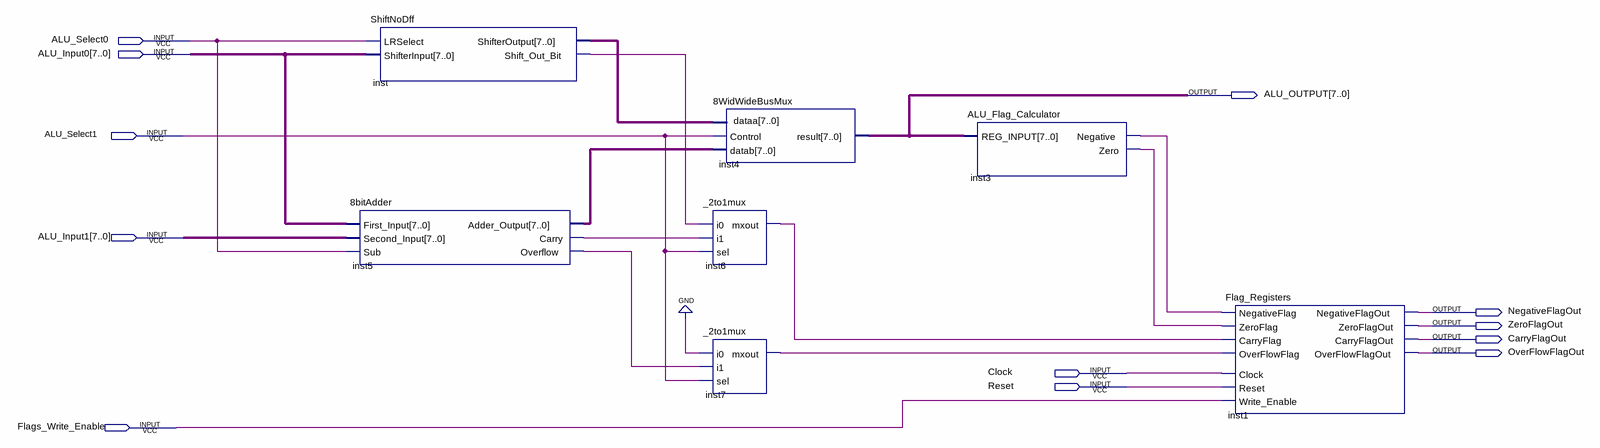
[diagram p0: schematic sheet]
// Quartus schematic ALU.bdf as structural Verilog: 7 symbols, 12 pins
module ALU (
  input  ALU_Select0,
  input  [7:0] ALU_Input0,
  input  ALU_Select1,
  input  [7:0] ALU_Input1,
  input  Clock,
  input  Reset,
  input  Flags_Write_Enable,
  output [7:0] ALU_OUTPUT,
  output NegativeFlagOut,
  output ZeroFlagOut,
  output CarryFlagOut,
  output OverFlowFlagOut
);

  wire inst3_negative, inst3_zero, inst5_carry, inst5_overflow, inst6_mxout, inst7_mxout, inst_shift_out_bit;
  wire [7:0] inst5_adder_output, inst_shifteroutput;

  \8bitAdder  inst5 (
    .Sub(ALU_Select0), .Second_Input(ALU_Input1), .First_Input(ALU_Input0), .Carry(inst5_carry),
    .Overflow(inst5_overflow), .Adder_Output(inst5_adder_output));
  ShiftNoDff inst (
    .LRSelect(ALU_Select0), .ShifterInput(ALU_Input0), .ShifterOutput(inst_shifteroutput),
    .Shift_Out_Bit(inst_shift_out_bit));
  \8WidWideBusMux  inst4 (
    .Control(ALU_Select1), .dataa(inst_shifteroutput), .datab(inst5_adder_output), .result(ALU_OUTPUT));
  _2to1mux inst6 (.i0(inst_shift_out_bit), .i1(inst5_carry), .sel(ALU_Select1), .mxout(inst6_mxout));
  _2to1mux inst7 (.i0(1'b0), .i1(inst5_overflow), .sel(ALU_Select1), .mxout(inst7_mxout));
  ALU_Flag_Calculator inst3 (.REG_INPUT(ALU_OUTPUT), .Negative(inst3_negative), .Zero(inst3_zero));
  Flag_Registers inst1 (
    .Write_Enable(Flags_Write_Enable), .Clock(Clock), .Reset(Reset), .ZeroFlag(inst3_zero),
    .NegativeFlag(inst3_negative), .OverFlowFlag(inst7_mxout), .CarryFlag(inst6_mxout),
    .ZeroFlagOut(ZeroFlagOut), .NegativeFlagOut(NegativeFlagOut), .OverFlowFlagOut(OverFlowFlagOut),
    .CarryFlagOut(CarryFlagOut));
endmodule
